# EAGLE board Anu-revC (EAGLE 5.09)
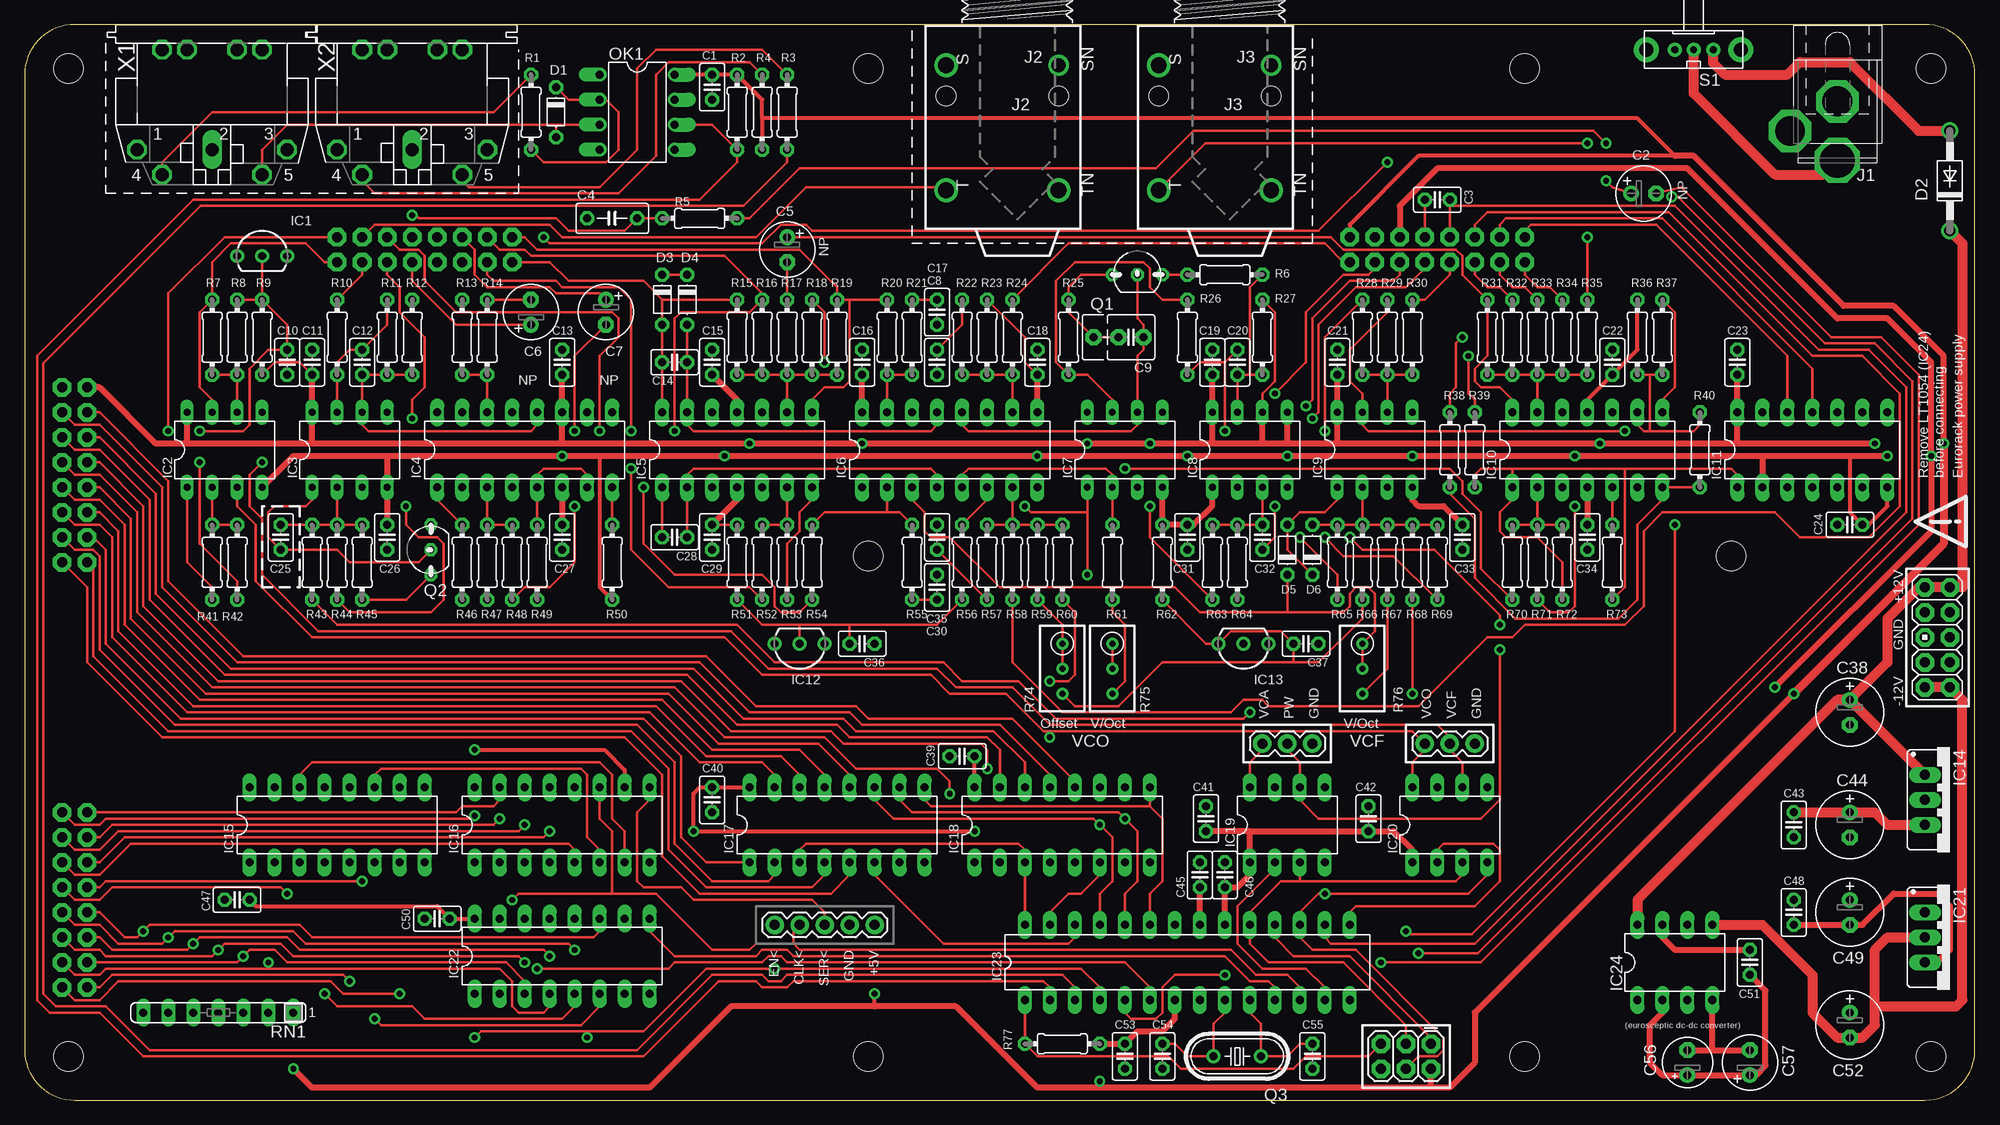
[diagram p5: board, top side]
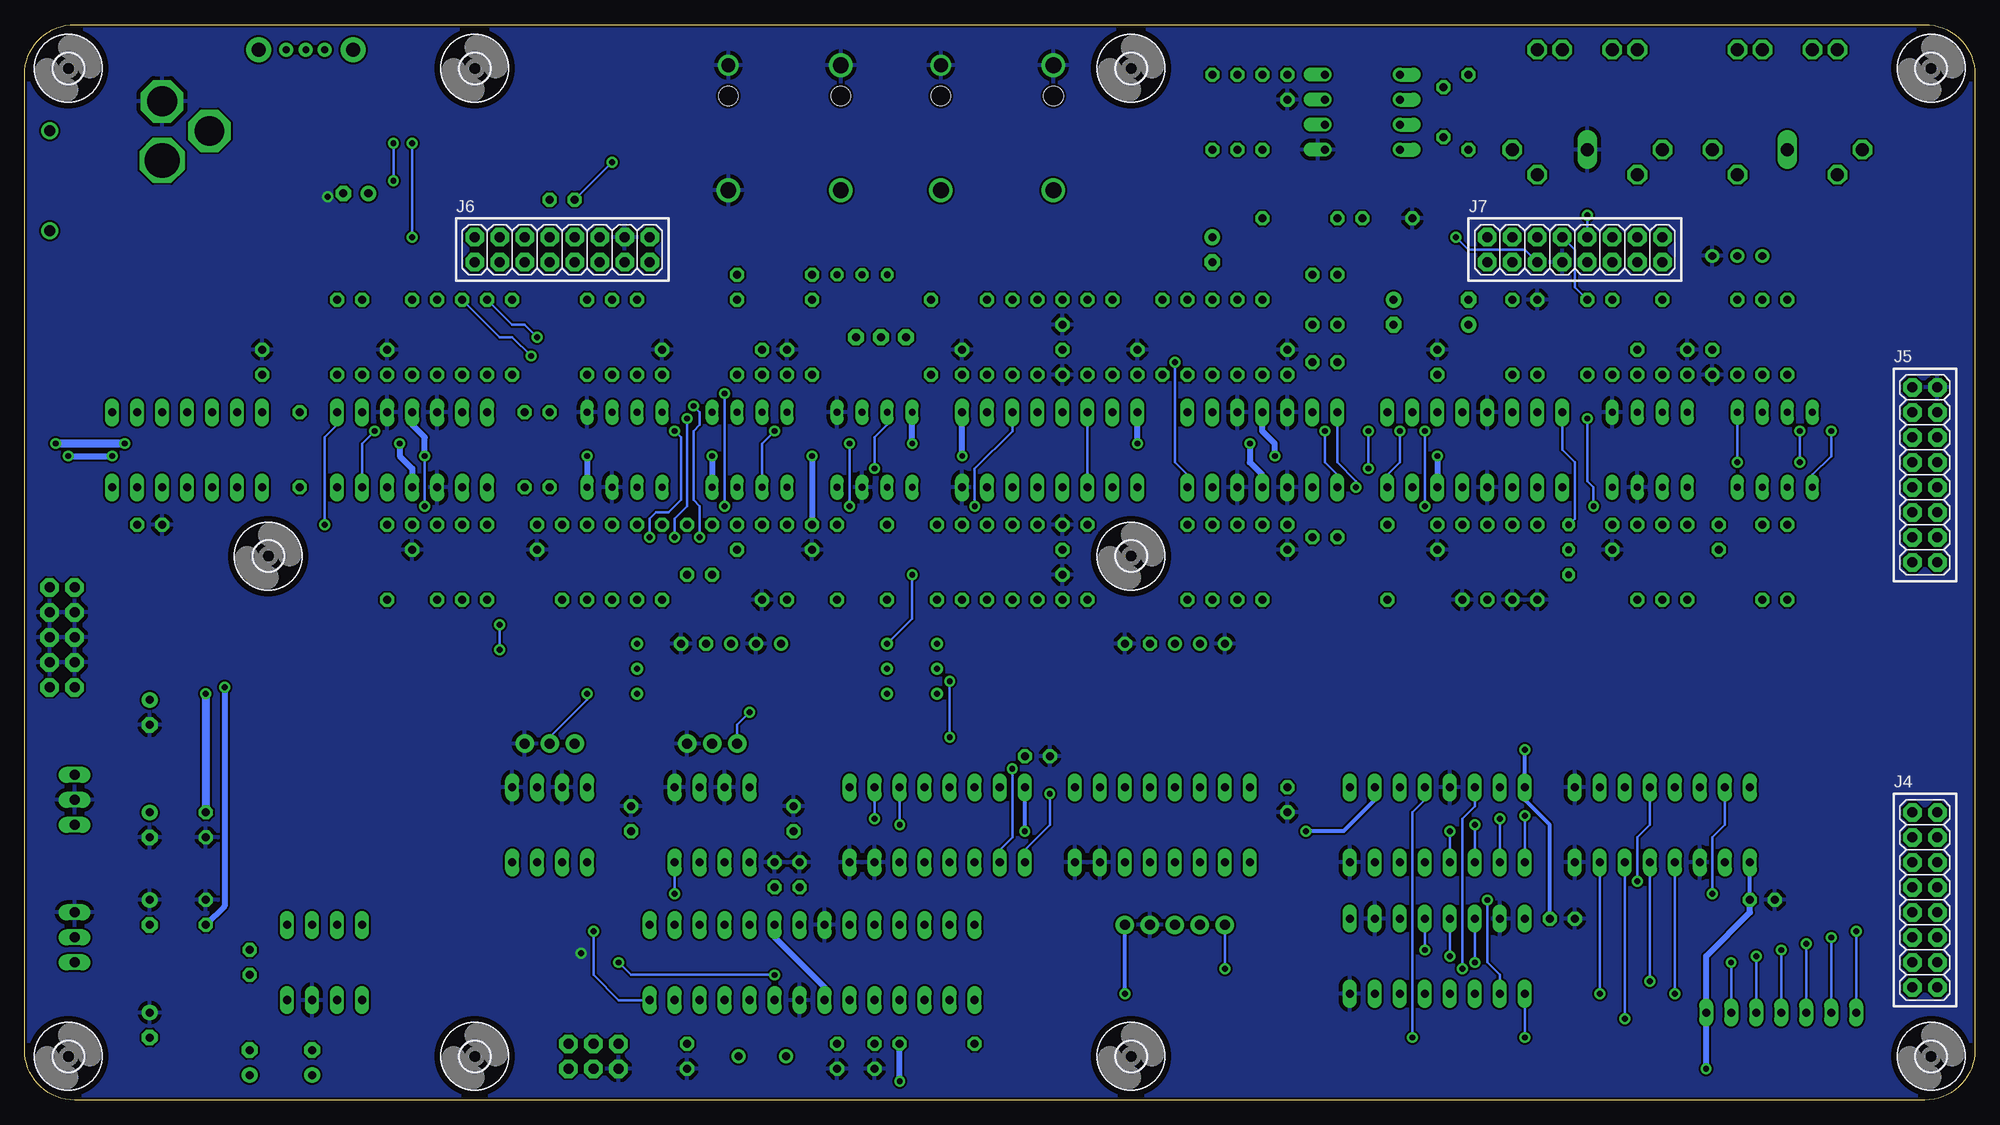
[diagram p6: board, bottom side, seen from below]

Size 198.12 x 109.22 mm. Coordinates in mm from the lower left corner, seen from the top.
Outline: 5.08,109.22 arc90 0,104.14 0,5.08 arc90 5.08,0 193.04,0 arc90 198.12,5.08 198.12,104.14 arc90 193.04,109.22 5.08,109.22
Copper layers (1*16): Top 0.035mm / dielectric 1.5mm / Bottom 0.035mm
Design rules "SparkFun *": minimum track width 8mil, minimum drill 20mil, track to track 8mil, track to pad 8mil, pad to pad 8mil, via to via 8mil, smd to smd 8mil, copper to edge 10mil, drill to drill 8mil, minimum pad ring 12mil, minimum via ring 10mil, stop-mask expansion 4mil, vias tented up to drill 25mil, thermal gap 16mil

## Footprints (pad centres in the part's own frame; a part is rotated, then mirrored left to right if it is on the bottom)
C025-025X050 = drill 0.813 octagon: 1 -1.27,0; 2 1.27,0
E2,5-6 = drill 0.813 pad 1.6 round: + -1.27,0 | drill 0.813 pad 1.6 octagon: - 1.27,0
C050-030X075 = drill 0.813 octagon: 1 -2.54,0; 2 2.54,0
C2.5/5-5 = drill 0.813 pad 1.6 octagon: 1 -1.27,0; 2 1.27,0; 3 3.81,0
E2,5-7 = drill 0.813 pad 1.6 round: + -1.27,0 | drill 0.813 pad 1.6 octagon: - 1.27,0
E2,5-5 = drill 0.813 pad 1.6 round: + -1.27,0 | drill 0.813 pad 1.6 octagon: - 1.27,0
D-5 = drill 0.813 octagon: A 2.54,0; C -2.54,0
DO41-10 = drill 1.118 round: A 5.08,0; C -5.08,0
LP_O-PBCY-W3 = drill 0.8 pad 1.4 round: 1 -2.54,0; 2 0,0; 3 2.54,0
DIL08 = drill 0.7 long: 1 -3.81,-3.81; 2 -1.27,-3.81; 3 1.27,-3.81; 4 3.81,-3.81; 5 3.81,3.81; 6 1.27,3.81; 7 -1.27,3.81; 8 -3.81,3.81
DIL16 = drill 0.813 long: 1 -8.89,-3.81; 2 -6.35,-3.81; 3 -3.81,-3.81; 4 -1.27,-3.81; 5 1.27,-3.81; 6 3.81,-3.81; 7 6.35,-3.81; 8 8.89,-3.81; 9 8.89,3.81; 10 6.35,3.81; 11 3.81,3.81; 12 1.27,3.81; 13 -1.27,3.81; 14 -3.81,3.81; 15 -6.35,3.81; 16 -8.89,3.81
DIL14 = drill 0.813 long: 1 -7.62,-3.81; 2 -5.08,-3.81; 3 -2.54,-3.81; 4 0,-3.81; 5 2.54,-3.81; 6 5.08,-3.81; 7 7.62,-3.81; 8 7.62,3.81; 9 5.08,3.81; 10 2.54,3.81; 11 0,3.81; 12 -2.54,3.81; 13 -5.08,3.81; 14 -7.62,3.81
78XXS = drill 1.016 long: GND 0,-2.54; IN -2.54,-2.54; OUT 2.54,-2.54
DIL08' = drill 0.813 long: 1 -3.81,-3.81; 2 -1.27,-3.81; 3 1.27,-3.81; 4 3.81,-3.81; 5 3.81,3.81; 6 1.27,3.81; 7 -1.27,3.81; 8 -3.81,3.81
79XXS = drill 1.016 long: GND -2.54,-2.54; IN 0,-2.54; OUT 2.54,-2.54
DIL28-3 = drill 0.813 long: 1 -16.51,-3.81; 2 -13.97,-3.81; 3 -11.43,-3.81; 4 -8.89,-3.81; 5 -6.35,-3.81; 6 -3.81,-3.81; 7 -1.27,-3.81; 8 1.27,-3.81; 9 3.81,-3.81; 10 6.35,-3.81; 11 8.89,-3.81; 12 11.43,-3.81; 13 13.97,-3.81; 14 16.51,-3.81; 15 16.51,3.81; 16 13.97,3.81; 17 11.43,3.81; 18 8.89,3.81; 19 6.35,3.81; 20 3.81,3.81; 21 1.27,3.81; 22 -1.27,3.81; 23 -3.81,3.81; 24 -6.35,3.81; 25 -8.89,3.81; 26 -11.43,3.81; 27 -13.97,3.81; 28 -16.51,3.81
2X3 = drill 1.016 pad 1.88 octagon: 1 0,0; 2 0,2.54; 3 2.54,0; 4 2.54,2.54; 5 5.08,0; 6 5.08,2.54
SPC4078_BIG_HOLES = drill 3.023 pad 4.318 octagon: 1 -0.46,0; 2 2.54,-4.8 | drill 3.531 pad 4.572 octagon: 3 5.54,0
NRJ4HF = drill 1.6 round: S 5.08,7.992; T -7.62,7.992; TN -7.62,-3.438 | drill 1.4 round: SN 5.08,-3.438 | hole 2: 1.948,7.992; 1.948,-3.438
2X8 = drill 1.016 pad 1.88 octagon: 1 0,0; 2 0,2.54; 3 2.54,0; 4 2.54,2.54; 5 5.08,0; 6 5.08,2.54; 7 7.62,0; 8 7.62,2.54; 9 10.16,0; 10 10.16,2.54; 11 12.7,0; 12 12.7,2.54; 13 15.24,0; 14 15.24,2.54; 15 17.78,0; 16 17.78,2.54
AVR_ICSP = drill 1.016 pad 1.88 octagon: 1 -1.27,5.08; 2 1.27,5.08; 3 -1.27,2.54; 4 1.27,2.54; 5 -1.27,0; 6 1.27,0; 7 -1.27,-2.54; 8 1.27,-2.54; 9 -1.27,-5.08; 10 1.27,-5.08
1X03 = drill 1.016 pad 1.88 round: 1 0,0; 2 2.54,0; 3 5.08,0
1X05 = drill 1.016 pad 1.88 round: 1 0,0; 2 2.54,0; 3 5.08,0; 4 7.62,0; 5 10.16,0
DIL08'' = drill 0.813 offset: 1 -3.81,-3.81; 2 -1.27,-3.81; 3 1.27,-3.81; 4 3.81,-3.81; 5 3.81,3.81; 6 1.27,3.81; 7 -1.27,3.81; 8 -3.81,3.81
TO92- = drill 0.7 octagon: 1 2.54,0; 2 0,0; 3 -2.54,0
HC49U-V = drill 0.813 round: 1 -2.413,0; 2 2.413,0
0204/7 = drill 0.813 octagon: 1 -3.81,0; 2 3.81,0
RTRIM3296W = drill 0.61 round: 1 0,-2.54; 2 0,0; 3 0,2.54
SIL7 = drill 0.813 long: 1 -7.62,0; 2 -5.08,0; 3 -2.54,0; 4 0,0; 5 2.54,0; 6 5.08,0; 7 7.62,0
EG1213 = drill 0.7 pad 1.422 round: 1 -2,0; 2 0,0; 3 1.9,0 | drill 1.4 pad 2.54 round: MT1 -4.8,0; MT2 4.8,0
3,0 = hole 3: 0,0
MAB5SH = drill 1.321 octagon: 1 7.62,7.62; 3 -7.62,7.62; 4 5.08,10.16; 5 -5.08,10.16; P$1 -5.08,-2.54; P$2 -2.54,-2.54; P$3 2.54,-2.54; P$4 5.08,-2.54 | drill 1.321 long: 2 0,7.62

## Placement (x,y rotation side)
C1  100n  [C025-025X050]  69.85,102.87 270 top
C2  4.7u  [E2,5-6]  164.47,92.08 0 top
C3  100n  [C025-025X050]  143.51,91.44 0 top
C4  22n  [C050-030X075]  59.69,89.53 180 top
C5  4.7u  [E2,5-6]  77.47,86.36 270 top
C6  4.7u  [E2,5-6]  51.44,80.01 90 top
C7  4.7u  [E2,5-6]  59.05,80.01 270 top
C8  560p  [C025-025X050]  92.71,80.01 270 top
C9  2.2n  [C2.5/5-5]  112.39,77.47 180 top
C10  100n  [C025-025X050]  26.67,74.93 270 top
C11  100n  [C025-025X050]  29.21,74.93 90 top
C12  100p  [C025-025X050]  34.29,74.93 90 top
C13  100n  [C025-025X050]  54.61,74.93 90 top
C14  220p  [C025-025X050]  66.04,74.93 180 top
C15  100n  [C025-025X050]  69.85,74.93 270 top
C16  100n  [C025-025X050]  85.09,74.93 90 top
C17  560p  [C025-025X050]  92.71,74.93 270 top
C18  100n  [C025-025X050]  102.87,74.93 270 top
C19  100n  [C025-025X050]  120.65,74.93 90 top
C20  10p  [C025-025X050]  123.19,74.93 270 top
C21  100n  [C025-025X050]  133.35,74.93 90 top
C22  100n  [C025-025X050]  161.29,74.93 270 top
C23  100n  [C025-025X050]  173.99,74.93 90 top
C24  100n  [C025-025X050]  185.42,58.42 0 top
C25  100n  [C025-025X050]  26.04,57.15 270 top
C26  100n  [C025-025X050]  36.83,57.15 90 top
C27  100n  [C025-025X050]  54.61,57.15 90 top
C28  220p  [C025-025X050]  66.04,57.15 180 top
C29  100n  [C025-025X050]  69.85,57.15 270 top
C30  560p  [C025-025X050]  92.71,57.15 90 top
C31  100n  [C025-025X050]  118.11,57.15 90 top
C32  560p  [C025-025X050]  125.73,57.15 270 top
C33  100n  [C025-025X050]  146.05,57.15 90 top
C34  100n  [C025-025X050]  158.75,57.15 270 top
C35  560p  [C025-025X050]  92.71,52.07 90 top
C36  100n  [C025-025X050]  85.09,46.35 0 top
C37  100n  [C025-025X050]  130.18,46.35 0 top
C38  100u  [E2,5-7]  185.42,39.37 270 top
C39  100n  [C025-025X050]  95.25,34.92 180 top
C40  100n  [C025-025X050]  69.85,30.48 270 top
C41  100n  [C025-025X050]  120.02,28.57 90 top
C42  100n  [C025-025X050]  136.53,28.57 90 top
C43  100n  [C025-025X050]  179.71,27.94 270 top
C44  100u  [E2,5-7]  185.42,27.94 270 top
C45  100n  [C025-025X050]  119.38,22.86 90 top
C46  100n  [C025-025X050]  121.92,22.86 90 top
C47  100n  [C025-025X050]  21.59,20.32 180 top
C48  100n  [C025-025X050]  179.71,19.05 270 top
C49  100u  [E2,5-7]  185.42,19.05 270 top
C50  100n  [C025-025X050]  41.91,18.41 180 top
C51  10p  [C025-025X050]  175.26,13.97 90 top
C52  100u  [E2,5-7]  185.42,7.62 270 top
C53  100n  [C025-025X050]  111.76,4.45 270 top
C54  18p  [C025-025X050]  115.57,4.45 90 top
C55  18p  [C025-025X050]  130.81,4.45 90 top
C56  10u  [E2,5-5]  168.91,3.81 90 top
C57  100u  [E2,5-6]  175.26,3.81 90 top
D1  1N4148  [D-5]  53.98,100.33 270 top
D2  1N4001  [DO41-10]  195.58,93.34 90 top
D3  3.6V  [D-5]  64.77,81.28 270 top
D4  3.6V  [D-5]  67.31,81.28 270 top
D5  1N4148  [D-5]  128.27,55.88 90 top
D6  1N4148  [D-5]  130.81,55.88 90 top
IC1  LM4040 4.1V  [LP_O-PBCY-W3]  24.13,85.72 0 top
IC2  TS912  [DIL08]  20.32,66.04 0 top
IC3  TL072P  [DIL08]  33.02,66.04 0 top
IC4  LM13700N  [DIL16]  50.8,66.04 0 top
IC5  TL074  [DIL14]  72.39,66.04 0 top
IC6  V2164D  [DIL16]  93.98,66.04 0 top
IC7  TL072P  [DIL08]  111.76,66.04 0 top
IC8  LM311N  [DIL08]  124.46,66.04 0 top
IC9  TL072P  [DIL08]  137.16,66.04 0 top
IC10  TL074  [DIL14]  158.75,66.04 0 top
IC11  4024N  [DIL14]  181.61,66.04 0 top
IC12  LM4040 4.1V  [LP_O-PBCY-W3]  78.74,46.35 180 top
IC13  LM4040 4.1V  [LP_O-PBCY-W3]  123.83,46.35 180 top
IC14  7805  [78XXS]  195.58,30.48 270 top
IC15  4050N  [DIL16]  31.75,27.94 0 top
IC16  74HC595N  [DIL16]  54.61,27.94 0 top
IC17  4051N  [DIL16]  82.55,27.94 0 top
IC18  4051N  [DIL16]  105.41,27.94 0 top
IC19  MCP4822  [DIL08']  128.27,27.94 0 top
IC20  MCP4822  [DIL08']  144.78,27.94 0 top
IC21  7905  [79XXS]  195.58,16.51 270 top
IC22  74HC165N  [DIL16]  54.61,14.61 0 top
IC23  ATMega328p  [DIL28-3]  118.11,13.97 0 top
IC24  LT1054  [DIL08']  167.64,13.97 0 top
ISP  AVR_ISP  [2X3]  142.88,5.71 180 top
J1  [SPC4078_BIG_HOLES]  184.15,100.97 270 top
J2  MONOSWSLIM  [NRJ4HF]  101.6,100.01 90 top
J3  MONOSWSLIM  [NRJ4HF]  123.19,100.01 90 top
J4  [2X8]  6.35,29.21 270 bottom
J5  [2X8]  6.35,72.39 270 bottom
J6  [2X8]  152.4,85.09 0 bottom
J7  [2X8]  49.53,85.09 0 bottom
JP1  M05X2PTH  [AVR_ICSP]  194.31,46.99 0 top
JP2  [1X03]  125.73,36.2 0 top
JP3  [1X03]  142.24,36.2 0 top
JP4  [1X05]  76.2,17.78 0 top
OK1  6N137  [DIL08'']  62.23,100.33 270 top
Q1  2N5485  [TO92-]  113.03,83.82 0 top
Q2  2N3906  [TO92-]  41.27,55.88 90 top
Q3  20MHz  [HC49U-V]  123.19,4.45 180 top
R1  220  [0204/7]  51.44,100.33 270 top
R2  10k  [0204/7]  72.39,100.33 90 top
R3  220  [0204/7]  74.93,100.33 270 top
R4  220  [0204/7]  77.47,100.33 90 top
R5  470  [0204/7]  68.58,89.53 0 top
R6  470  [0204/7]  121.92,83.82 180 top
R7  100k  [0204/7]  19.05,77.47 270 top
R8  100k  [0204/7]  21.59,77.47 270 top
R9  470  [0204/7]  24.13,77.47 270 top
R10  470  [0204/7]  31.75,77.47 270 top
R11  22k  [0204/7]  36.83,77.47 270 top
R12  33k  [0204/7]  39.37,77.47 90 top
R13  220  [0204/7]  44.45,77.47 270 top
R14  22k  [0204/7]  46.99,77.47 90 top
R15  200k  [0204/7]  72.39,77.47 270 top
R16  33k  [0204/7]  74.93,77.47 90 top
R17  33k  [0204/7]  77.47,77.47 270 top
R18  15k  [0204/7]  80.01,77.47 90 top
R19  33k  [0204/7]  82.55,77.47 90 top
R20  33k  [0204/7]  87.63,77.47 270 top
R21  470  [0204/7]  90.17,77.47 270 top
R22  470  [0204/7]  95.25,77.47 270 top
R23  22k  [0204/7]  97.79,77.47 270 top
R24  33k  [0204/7]  100.33,77.47 270 top
R25  4.7k  [0204/7]  106.05,77.47 90 top
R26  22k  [0204/7]  118.11,77.47 270 top
R27  470  [0204/7]  125.73,77.47 90 top
R28  12k  [0204/7]  135.89,77.47 270 top
R29  10k  [0204/7]  138.43,77.47 90 top
R30  15k  [0204/7]  140.97,77.47 270 top
R31  33k  [0204/7]  148.59,77.47 90 top
R32  150k  [0204/7]  151.13,77.47 270 top
R33  100k  [0204/7]  153.67,77.47 270 top
R34  100k  [0204/7]  156.21,77.47 270 top
R35  15k  [0204/7]  158.75,77.47 270 top
R36  22k  [0204/7]  163.83,77.47 270 top
R37  10k  [0204/7]  166.37,77.47 90 top
R38  4.7k  [0204/7]  144.78,66.04 90 top
R39  4.7k  [0204/7]  147.32,66.04 90 top
R40  22k  [0204/7]  170.18,66.04 90 top
R41  100k  [0204/7]  19.05,54.61 270 top
R42  100k  [0204/7]  21.59,54.61 90 top
R43  22k  [0204/7]  29.21,54.61 90 top
R44  22k  [0204/7]  31.75,54.61 90 top
R45  4.7k  [0204/7]  34.29,54.61 270 top
R46  22k  [0204/7]  44.45,54.61 270 top
R47  22k  [0204/7]  46.99,54.61 270 top
R48  100k  [0204/7]  49.53,54.61 90 top
R49  10k  [0204/7]  52.07,54.61 90 top
R50  4.7k  [0204/7]  59.69,54.61 90 top
R51  470  [0204/7]  72.39,54.61 90 top
R52  4.7k  [0204/7]  74.93,54.61 90 top
R53  4.7k  [0204/7]  77.47,54.61 270 top
R54  33k  [0204/7]  80.01,54.61 90 top
R55  470  [0204/7]  90.17,54.61 90 top
R56  68k  [0204/7]  95.25,54.61 90 top
R57  470  [0204/7]  97.79,54.61 90 top
R58  200k  [0204/7]  100.33,54.61 90 top
R59  68k  [0204/7]  102.87,54.61 90 top
R60  100k  [0204/7]  105.41,54.61 90 top
R61  100k  [0204/7]  110.49,54.61 270 top
R62  470  [0204/7]  115.57,54.61 270 top
R63  10k  [0204/7]  120.65,54.61 270 top
R64  10k  [0204/7]  123.19,54.61 90 top
R65  200k  [0204/7]  133.35,54.61 90 top
R66  62k  [0204/7]  135.89,54.61 90 top
R67  33k  [0204/7]  138.43,54.61 270 top
R68  49.9k  [0204/7]  140.97,54.61 90 top
R69  200k  [0204/7]  143.51,54.61 90 top
R70  10k  [0204/7]  151.13,54.61 90 top
R71  39k  [0204/7]  153.67,54.61 90 top
R72  27k  [0204/7]  156.21,54.61 270 top
R73  10k  [0204/7]  161.29,54.61 90 top
R74  10k  [RTRIM3296W]  105.41,43.81 180 top
R75  10k  [RTRIM3296W]  110.49,43.81 180 top
R76  10k  [RTRIM3296W]  135.89,43.81 180 top
R77  10k  [0204/7]  105.41,5.71 0 top
RN1  10k  [SIL7]  19.68,8.89 180 top
S1  EG1213  [EG1213]  169.54,106.68 180 top
U$2  [BOX]  152.4,22.23 0 top
U$3  [3,0]  193.68,4.45 0 bottom
U$4  [3,0]  152.4,4.45 0 bottom
U$5  [3,0]  85.72,4.45 0 bottom
U$6  [3,0]  4.45,4.45 0 bottom
U$7  [3,0]  173.35,55.24 0 bottom
U$8  [3,0]  85.72,55.24 0 bottom
U$9  [3,0]  193.68,104.78 0 bottom
U$10  [3,0]  152.4,104.78 0 bottom
U$11  [3,0]  85.72,104.78 0 bottom
U$12  [3,0]  4.45,104.78 0 bottom
U$13  [V2_LOGO_ANUSHRI_MAIN_BOARD]  4.76,37.47 0 top
X1  MIDI_IN  [MAB5SH]  19.05,104.14 180 top
X2  MIDI_OUT  [MAB5SH]  39.37,104.14 180 top

## Tracks (layer width: path | path; a pad name or v marks a point on that pad's centre or on a via)
-1_OCT
  Top 0.254: IC11.12 179.07,75.56 165.74,88.9 153.03,88.9 152.4,88.27 J6.2
-2_OCT
  Top 0.254: IC11.11 181.61,74.3 166.37,89.53 150.5,89.53 149.86,88.9 J6.4
ADC
  Top 0.254: IC23.28 IC18.3 101.6,25.4 100.97,26.04 79.38,26.04 78.74,25.4 IC17.3
ADC_ADDR0  (via drill 0.6)
  Top 0.254: IC23.25 109.22,20.95 110.49,22.23 110.49,26.67 v109.22,27.94 108.58,28.57 88.27,28.57 86.36,30.48 IC17.11
  Bottom 0.254: v109.22,27.94 IC18.11
ADC_ADDR1  (via drill 0.6)
  Top 0.254: IC23.24 111.76,20.95 113.03,22.23 113.03,27.3 v111.76,28.57 111.12,29.21 90.17,29.21 88.9,30.48 IC17.10
  Bottom 0.254: v111.76,28.57 IC18.10
ADC_ADDR2
  Top 0.254: 114.3,29.84 92.08,29.84 91.44,30.48 IC17.9 | IC23.23 114.3,20.95 115.57,22.23 115.57,28.57 114.3,29.84 | 114.3,29.84 IC18.9
ADC_ADDR3
  Top 0.254: IC23.26 106.68,16.51 106.05,15.88 93.34,15.88 86.36,22.86 IC17.6
ADC_ADDR4
  Top 0.254: IC18.6 109.22,22.86 107.31,20.95 106.05,20.95 104.14,19.05 IC23.27
AREF
  Top 0.61: IC23.21 C45.1
BP  (via drill 0.6)
  Top 0.254: IC5.14 C14.2 D3.A 64.77,81.28 | v62.87,62.23 62.87,56.52 66.04,53.34 74.93,53.34 76.2,52.07 76.2,50.16 76.83,49.53 78.74,49.53 R54.1 | 64.77,81.28 62.87,83.19 55.24,83.19 53.34,85.09 J7.1 | 64.77,81.28 R15.1
  Bottom 0.254: v62.87,62.23 62.87,62.87 64.77,64.77 IC5.14
CLK_OUT  (via drill 0.6)
  Top 0.254: v26.67,20.95 26.04,21.59 8.89,21.59 7.62,20.32 5.08,20.32 J4.8
  Bottom 0.254: v26.67,20.95 26.67,26.67 25.4,27.94 IC15.15
CUTOFF_POT  (via drill 0.6)
  Top 0.254: v130.18,70.48 130.81,71.12 130.81,79.38 134.62,83.19 139.06,83.19 139.7,83.82 J6.11 | R65.1 133.35,53.34 v129.54,57.15
  Bottom 0.254: v130.18,70.48 129.54,69.85 129.54,68.58 130.18,67.94 130.18,60.96 129.54,60.33 v129.54,57.15
DAC_CUTOFF  (via drill 0.6)
  Top 0.254: v24.13,64.77 22.86,63.5 22.86,60.33 24.13,59.05 24.13,53.34 29.84,47.62 71.75,47.62 75.56,43.81 92.71,43.81 94.61,41.91 100.33,41.91 104.14,38.1 143.51,38.1 144.78,36.83 JP3.2 144.78,35.56 146.05,34.29 IC20.6 | v140.97,41.27 R68.1
  Bottom 0.254: v24.13,64.77 IC2.5 | v140.97,41.27 140.97,40.64 144.78,36.83 JP3.2
DAC_GAIN  (via drill 0.6)
  Top 0.254: v124.46,39.37 123.83,38.73 104.78,38.73 100.97,42.55 95.25,42.55 93.34,44.45 76.2,44.45 72.39,48.26 36.2,48.26 34.92,48.26 31.75,48.26 R43.1 | JP2.1 125.73,35.56 124.46,34.29 IC19.8
  Bottom 0.254: v124.46,39.37 125.73,38.1 JP2.1
DAC_PITCH  (via drill 0.6)
  Top 0.254: 104.14,37.47 103.5,37.47 99.69,41.27 93.98,41.27 92.08,43.18 74.93,43.18 71.12,46.99 29.21,46.99 23.5,52.7 23.5,58.42 21.59,60.33 IC2.3 | 104.14,37.47 v104.14,36.83 | IC20.8 140.97,34.29 142.24,35.56 JP3.1 140.97,37.47 104.14,37.47 | v104.14,42.55 106.05,42.55 106.68,43.18 106.68,49.53 R60.1
  Bottom 0.254: v104.14,36.83 v104.14,42.55
DAC_PW  (via drill 0.6)
  Top 0.254: R28.1 132.08,77.47 v132.08,67.94 | v134.62,57.15 135.89,55.88 143.19,55.88 149.86,49.21 v149.86,48.26 | JP2.2 128.27,35.56 129.54,34.29 IC19.6 129.54,30.48 131.44,28.57 147.96,28.57 149.86,30.48 v149.86,45.72
  Bottom 0.254: v134.62,57.15 134.62,59.05 133.99,59.69 132.72,59.69 131.44,60.96 131.44,67.31 v132.08,67.94 | v149.86,45.72 v149.86,48.26
DRUMS_OUT  (via drill 0.6)
  Top 0.254: R5.1 C4.1 60.96,88.27 55.24,88.27 53.98,89.53 40.01,89.53 39.69,89.85 v39.37,89.85
  Bottom 0.254: J7.10 v39.37,89.85
DRUMS_RETURN
  Bottom 0.254: R12.2 40.64,82.55 40.64,86.36 J7.8
DSQUARE
  Top 0.254: IC23.16 132.08,16.51 132.72,15.88 147.32,15.88 191.13,59.69 191.13,72.39 187.32,76.2 182.25,76.2 167.64,90.81 144.78,90.81 | 144.78,90.81 C3.2 | 144.78,90.81 J6.8
ENV_VCF
  Top 0.254: IC18.14 101.6,34.29 98.42,37.47 84.45,37.47 83.19,38.73 73.03,38.73 67.94,43.81 20.95,43.81 13.34,51.44 13.34,61.59 7.62,67.31 J5.5
F_CV
  Top 0.254: IC6.3 90.17,60.96 91.44,59.69 91.44,57.78 92.08,57.15 93.98,57.15 99.06,52.07 116.84,52.07 119.38,49.53 128.27,49.53 | 128.27,49.53 D5.C | 128.27,49.53 133.99,49.53 134.62,50.16 134.62,51.44 135.25,52.07 136.53,52.07 137.16,51.44 137.16,47.62 R76.1 R76.2
  Bottom 0.254: IC6.3 IC6.14
FM_IN  (via drill 0.6)
  Top 0.254: v138.43,95.25 131.44,88.27 80.01,88.27 79.38,88.9 76.83,88.9 74.93,87 53.34,87 v52.7,87.63 | C3.1 J6.10
  Bottom 0.254: v138.43,95.25 C3.1 | v52.7,87.63 51.44,86.36 45.72,86.36 J7.5
FM_OUT
  Top 0.254: R24.1 106.05,87 132.08,87 133.99,85.09 J6.15
GATE_OUT  (via drill 0.6)
  Top 0.254: v34.29,22.23 8.26,22.23 7.62,21.59 J4.7
  Bottom 0.254: v34.29,22.23 34.29,26.67 33.02,27.94 IC15.12
GND  (via drill 0.6)
  Top 0.254: v167.32,91.76 167.96,91.76 182.88,76.83 187.96,76.83 191.77,73.03 191.77,59.05 147.64,14.92 v141.6,14.92
  pour Bottom: 0,5.08 arc90 5.08,0 193.04,0 arc90 198.12,5.08 198.12,104.14 arc90 193.04,109.22 5.08,109.22 arc90 0,104.14
HP
  Top 0.254: 83.82,81.28 R19.2 82.55,82.55 78.74,86.36 52.07,86.36 50.8,87.63 J7.2 | 83.82,81.28 R20.1 | IC5.8 80.01,71.12 81.28,72.39 83.19,72.39 83.82,73.03 83.82,81.28
IN1  (via drill 0.6)
  Top 0.254: IC22.11 58.42,17.14 57.78,16.51 29.21,16.51 27.94,17.78 12.7,17.78 v12.06,17.14 11.43,16.51 10.16,16.51 7.62,19.05 J4.9
  Bottom 0.254: RN1.7 v12.06,17.14
IN2  (via drill 0.6)
  Top 0.254: v55.88,15.24 55.24,15.88 28.57,15.88 27.3,17.14 15.24,17.14 v14.61,16.51 13.97,15.88 9.53,15.88 7.62,17.78 5.08,17.78 J4.10
  Bottom 0.254: v55.88,15.24 IC22.12 | RN1.6 v14.61,16.51
IN3  (via drill 0.6)
  Top 0.254: v53.34,14.61 52.7,15.24 27.94,15.24 26.67,16.51 17.78,16.51 v17.14,15.88 16.51,15.24 8.89,15.24 7.62,16.51 J4.11
  Bottom 0.254: v53.34,14.61 IC22.13 | v17.14,15.88 RN1.5
IN4  (via drill 0.6)
  Top 0.254: v50.8,13.97 50.16,14.61 27.3,14.61 26.04,15.88 20.32,15.88 v19.68,15.24 19.05,14.61 8.26,14.61 7.62,15.24 5.08,15.24 J4.12
  Bottom 0.254: v50.8,13.97 IC22.14 | v19.68,15.24 RN1.4
IN5  (via drill 0.6)
  Top 0.254: IC22.3 50.8,12.06 48.9,13.97 26.67,13.97 25.4,15.24 22.86,15.24 v22.23,14.61 21.59,13.97 J4.13
  Bottom 0.254: v22.23,14.61 RN1.3
IN6  (via drill 0.6)
  Top 0.254: IC22.4 53.34,9.53 52.7,8.89 50.16,8.89 49.53,9.53 49.53,12.06 48.26,13.34 24.77,13.34 | J4.14 5.08,12.7 7.62,12.7 8.26,13.34 24.77,13.34 | 24.77,13.34 v24.77,13.97
  Bottom 0.254: v24.77,13.97 RN1.2
IN7  (via drill 0.6)
  Top 0.254: v33.02,12.06 32.38,12.7 8.89,12.7 7.62,11.43 J4.15
  Bottom 0.254: v33.02,12.06 IC15.5
IN8  (via drill 0.6)
  Top 0.254: v38.1,10.79 32.38,10.79 31.11,12.06 9.53,12.06 7.62,10.16 5.08,10.16 J4.16
  Bottom 0.254: v38.1,10.79 IC15.7
IO_ENABLE  (via drill 0.6)
  Top 0.254: 57.15,6.99 46.35,6.99 v45.72,6.35 | 57.15,6.99 62.87,6.99 69.22,13.34 v76.2,13.34 107.31,13.34 109.22,11.43 IC23.4 | 57.15,6.99 v57.15,6.35
  Bottom 0.254: v45.72,6.35 IC22.1 | IC16.12 55.88,30.48 57.15,29.21 v57.15,6.35 | v76.2,13.34 JP4.1
IO_INPUT
  Top 0.254: IC23.11 127,11.43 126.36,12.06 124.46,12.06 121.92,14.61 78.11,14.61 77.47,15.24 74.93,15.24 74.3,14.61 66.04,14.61 63.5,17.14 IC22.9
IO_OUTPUT  (via drill 0.6)
  Top 0.254: IC23.6 114.3,11.43 111.76,13.97 77.47,13.97 76.83,14.61 75.56,14.61 74.93,13.97 66.04,13.97 65.41,13.34 v52.07,13.34
  Bottom 0.254: v52.07,13.34 52.07,28.57 50.8,29.84 IC16.14
IO_SCK  (via drill 0.6)
  Top 0.254: IC23.12 129.54,11.43 128.27,12.7 125.09,12.7 122.56,15.24 78.74,15.24 78.11,15.88 | 78.11,15.88 74.3,15.88 73.66,15.24 69.85,15.24 64.14,20.95 59.69,20.95 | IC16.11 58.42,28.57 59.69,27.3 59.69,20.95 | 59.69,20.95 50.16,20.95 v49.53,20.32 | JP4.2 78.11,17.14 78.11,15.88
  Bottom 0.254: v49.53,20.32 49.53,13.97 48.26,12.7 IC22.2
IO_XT
  Top 0.254: IC16.9 63.5,30.48 62.23,29.21 62.23,22.23 62.87,21.59 66.67,21.59 67.94,20.32 80.01,20.32 81.28,19.05 JP4.3
LED1
  Top 0.254: IC16.15 48.26,30.48 47.62,29.84 44.45,29.84 43.81,29.21 J4.1
LED2  (via drill 0.6)
  Top 0.254: v45.72,28.89 45.4,28.57 8.26,28.57 7.62,27.94 5.08,27.94 J4.2
  Bottom 0.254: v45.72,28.89 IC16.1
LED3  (via drill 0.6)
  Top 0.254: v48.26,28.57 47.62,27.94 8.89,27.94 7.62,26.67 J4.3
  Bottom 0.254: v48.26,28.57 IC16.2
LED4  (via drill 0.6)
  Top 0.254: v50.8,27.94 50.16,27.3 9.53,27.3 7.62,25.4 5.08,25.4 J4.4
  Bottom 0.254: IC16.3 v50.8,27.94 50.48,27.62
LED5  (via drill 0.6)
  Top 0.254: v53.34,27.3 52.7,26.67 10.16,26.67 7.62,24.13 J4.5
  Bottom 0.254: v53.34,27.3 IC16.4
LED6
  Top 0.254: IC16.5 55.88,25.4 55.24,26.04 10.79,26.04 7.62,22.86 5.08,22.86 J4.6
LFO_VCF
  Top 0.254: IC18.13 104.14,33.02 99.06,38.1 85.09,38.1 83.82,39.37 73.66,39.37 68.58,44.45 21.59,44.45 13.97,52.07 13.97,62.23 7.62,68.58 5.08,68.58 J5.4
LP  (via drill 0.6)
  Top 0.254: C28.2 IC5.1 | v66.04,67.94 66.04,79.38 66.67,80.01 73.66,80.01 R16.2 74.93,81.92 71.12,85.72 51.44,85.72 50.8,86.36 48.26,86.36 J7.4
  Bottom 0.254: IC5.1 64.77,63.5 66.04,64.77 v66.04,67.94
MIDI_IN
  Top 0.254: OK1.6 69.85,99.06 R2.1 72.39,95.25 68.58,91.44 17.14,91.44 1.27,75.56 1.27,10.16 2.54,8.89 7.62,8.89 12.06,4.45 62.87,4.45 70.48,12.06 74.3,12.06 74.93,11.43 77.47,11.43 78.11,12.06 103.5,12.06 104.14,11.43 IC23.2
MIDI_IN4
  Top 0.254: R1.1 47.62,100.33 19.05,100.33 13.97,95.25 X1.4
MIDI_IN5
  Top 0.254: 53.98,99.06 OK1.3 | X1.5 24.13,96.52 26.67,99.06 53.98,99.06 | 53.98,99.06 D1.A
MIDI_OUT
  Top 0.254: IC23.3 106.68,11.43 105.41,12.7 77.47,12.7 76.83,12.06 75.56,12.06 74.93,12.7 69.85,12.7 62.23,5.08 12.7,5.08 8.26,9.53 3.17,9.53 1.91,10.79 1.91,74.82 17.89,90.81 73.03,90.81 77.47,95.25 R4.1
MIDI_OUT3
  Top 0.254: R3.1 73.66,105.41 65.41,105.41 64.14,104.14 64.14,95.89 60.33,92.08 35.56,92.08 34.29,93.34 X2.4
MIDI_OUT5
  Top 0.254: R4.2 74.93,106.68 64.14,106.68 62.23,104.78 62.23,96.52 58.42,92.71 45.09,92.71 44.45,93.34 X2.5
MISO
  Top 0.254: IC23.18 127,16.51 128.91,14.61 134.62,14.61 142.88,6.35 ISP.1
MIX
  Top 0.254: C5.+ 132.72,87.63 133.99,86.36 145.41,86.36 146.05,85.72 146.05,83.82 R31.2 148.59,75.56 147.32,74.3 147.32,73.03 147.96,72.39 149.86,72.39 151.13,71.12 IC10.14
MIX_SAW  (via drill 0.6)
  Top 0.254: v146.69,75.56 146.69,71.75 147.32,71.12 R39.2 | J6.3 149.86,83.82 151.13,82.55 152.4,82.55 R33.1
  Bottom 0.254: R33.1 149.86,77.47 148.59,77.47 v146.69,75.56
MIX_SQUARE  (via drill 0.6)
  Top 0.254: R38.2 144.78,71.75 145.41,72.39 145.41,76.83 v146.05,77.47 | J6.5 147.32,83.82 148.59,82.55 149.86,82.55 R32.1
  Bottom 0.254: v146.05,77.47 147.32,78.74 148.59,78.74 R32.1
MOSI  (via drill 0.6)
  Top 0.254: IC20.4 148.59,22.86 146.69,20.95 v132.08,20.95 131.44,20.95 129.54,19.05 IC23.17 129.54,16.51 130.81,15.24 135.25,15.24 144.15,6.35 144.15,5.08 143.51,4.45 141.6,4.45 ISP.4
  Bottom 0.254: v132.08,20.95 IC19.4
N$1  (via drill 0.6)
  Top 0.254: v101.6,60.33 102.23,59.69 107.95,59.69 | R75.2 R75.1 | v107.95,53.34 107.95,59.69 | 107.95,59.69 IC7.1
  Bottom 0.254: v101.6,60.33 101.6,64.14 97.79,67.94 IC6.11 | R75.1 107.95,48.9 v107.95,53.34
N$2
  Top 0.254: 124.46,73.66 C20.2 IC8.7 | 124.46,73.66 R27.1 | 124.46,73.66 124.46,82.55 R6.1
N$3
  Top 0.254: IC16.6 58.42,25.4 57.15,26.67 57.15,33.02 56.52,33.66 36.2,33.66 35.56,33.02 IC15.11
N$4
  Top 0.254: IC16.7 60.96,27.3 59.69,28.57 59.69,33.02 58.42,34.29 29.21,34.29 27.94,33.02 IC15.14
N$5  (via drill 0.6)
  Top 0.254: R5.2 73.66,89.53 78.74,94.61 114.94,94.61 118.75,98.42 159.38,98.42 v160.66,97.16 | v160.66,93.34 161.29,92.71 C2.+
  Bottom 0.254: v160.66,93.34 v160.66,97.16
N$6
  Top 1.016: J1.3 182.71,93.98 177.8,93.98 169.54,102.23 S1.2
N$7
  Top 1.016: D2.A 192.41,98.42 185.42,105.41 180.34,105.41 179.07,104.14 172.72,104.14 171.54,105.31 S1.1
N$8
  Top 0.61: IC24.2 166.37,8.89 165.1,7.62 165.1,3.81 166.37,2.54 C56.+ C57.+ 175.9,2.54 176.85,3.49 176.85,11.11 C51.1
N$9
  Top 0.254: R15.2 R16.1 R17.2 | R19.1 R18.1 R17.2 | IC5.9 R17.2
N$10
  Top 0.254: IC6.4 92.71,63.5 92.08,64.14 67.94,64.14 67.31,63.5 IC5.2 C28.1
N$11
  Top 0.254: R21.1 C8.1
N$12
  Top 0.254: R75.3 111.76,42.55 111.76,48.26 110.49,49.53 R61.2
N$13
  Top 0.254: R52.2 R53.1 IC5.6
N$14  (via drill 0.6)
  Top 0.254: v81.28,74.93 81.28,80.01 R18.2 | IC5.7 80.01,60.96 78.74,59.69 78.74,57.78 77.47,56.52 R53.2
  Bottom 0.254: IC5.7 80.01,63.5 81.28,64.77 v81.28,74.93
N$15
  Top 0.254: R17.1 C5.-
N$16
  Top 0.254: Q1.1 R6.2
N$17
  Top 0.254: R55.1 C35.1
N$19
  Top 0.254: D4.A C14.1 IC5.13 67.31,68.58 67.94,67.94 92.08,67.94 92.71,68.58 IC6.13
N$21
  Top 0.254: R67.2 138.43,43.81 R76.3
N$22
  Bottom 0.254: Q2.1 40.64,59.05 40.64,64.77 41.91,66.04 IC4.16
N$25  (via drill 0.6)
  Top 0.254: J3.T 119.96,97.16 v158.75,97.16 | v158.75,87.63 R35.1
  Bottom 0.254: v158.75,97.16 v158.75,87.63
N$26
  Top 0.254: R54.2 81.28,59.69 87.63,59.69 | 87.63,59.69 88.9,59.69 R55.2 | 87.63,59.69 IC6.2
N$27  (via drill 0.6)
  Top 0.254: v55.88,67.94 55.88,75.56 C7.- | v55.88,60.33 55.88,54.61 53.34,52.07 50.8,52.07 R48.1
  Bottom 0.254: v55.88,60.33 v55.88,67.94
N$28
  Top 0.254: D1.C 55.24,101.6 OK1.2 59.05,101.6 60.33,100.33 60.33,96.52 59.05,95.25 52.7,95.25 R1.2
N$29
  Top 0.254: R21.2 R20.2 IC6.15
N$32
  Top 0.254: R14.2 C6.-
N$38
  Top 0.254: IC9.1 133.35,60.96 132.08,59.69 129.54,59.69 D5.A 128.27,55.88 D6.C
N$39
  Top 0.254: R45.2 38.73,50.8 Q2.3
N$40
  Top 0.254: R69.2 R68.2 R67.1 R66.2 | D6.A R65.2 R66.2 | R66.2 IC9.2
N$43  (via drill 0.6)
  Top 0.254: IC22.5 55.88,9.53 54.61,8.26 40.64,8.26 39.37,9.53 31.75,9.53 v30.48,10.79
  Bottom 0.254: v30.48,10.79 IC15.4
N$44  (via drill 0.6)
  Top 0.254: IC22.6 58.42,9.53 56.52,7.62 36.2,7.62 v35.56,8.26
  Bottom 0.254: v35.56,8.26 IC15.6
N$47
  Top 0.254: R74.2 R74.1 105.41,48.26 R59.1
N$48
  Top 0.61: 171.45,5.08 C57.- | C56.- 171.45,5.08 | 171.45,5.08 IC24.4
N$49
  Top 0.61: C51.2 167.64,15.24 166.37,16.51 IC24.7
N$50
  Top 0.254: IC3.1 29.21,60.96 28.57,60.33 25.4,60.33 24.77,59.69 24.77,57.15 C25.2 31.75,55.88 33.02,54.61 40.01,54.61 Q2.2
N$51
  Top 0.254: IC6.12 95.25,68.58 95.89,67.94 112.39,67.94 113.03,68.58 IC7.6 113.03,75.56 113.67,76.2 C9.1 113.67,78.74 113.03,79.38 Q1.2
N$52
  Top 0.254: R13.2 R14.1 IC4.14
N$55
  Top 0.254: D3.C D4.C
N$57
  Top 0.254: IC8.3 C32.1 R64.2 R63.1
N$60
  Top 0.254: R56.2 97.79,60.96 IC6.6
N$61
  Top 0.254: R29.1 R30.2 | R29.1 R28.2 | IC9.6 R29.1
N$62
  Top 0.254: R58.2 IC6.7 | R60.2 R59.2 R58.2 | R57.2 R58.2
N$63
  Top 0.254: IC3.7 R10.2 31.75,74.93 33.02,76.2 C12.2 36.83,78.74 R11.1
N$64
  Top 0.254: C30.1 R57.1
N$70
  Top 0.254: IC4.12 52.07,68.58 51.44,67.94 34.92,67.94 34.29,68.58 IC3.6 C12.1 R11.2 R12.1
N$71
  Top 0.254: R42.2 R41.1 IC2.2
N$75
  Top 0.254: IC2.6 R8.2 R7.2
N$77
  Top 0.254: IC6.5 95.25,63.5 95.89,64.14 109.86,64.14 110.49,63.5 IC7.2 R61.1
N$79
  Top 0.254: R22.2 R23.2 R24.2 IC6.10
N$80
  Top 0.254: C17.1 95.25,78.74 R22.1
N$81  (via drill 0.6)
  Top 0.254: v162.56,67.94 136.53,67.94 135.89,68.58 IC9.7 135.89,71.75 134.62,73.03 134.62,76.2 138.43,80.01 R29.2
  Bottom 0.254: v162.56,67.94 163.83,66.67 IC10.6
N$82
  Top 0.254: IC23.10 124.46,8.89 125.6,7.75 Q3.1 128.27,4.45 129.54,5.71 C55.2
N$83
  Top 0.254: IC23.9 121.92,8.89 120.78,7.75 Q3.2 118.11,4.45 116.84,5.71 C54.2
N$85
  Top 0.254: R71.2 IC10.2 | R71.2 R72.1 | R70.2 R71.2
N$86  (via drill 0.6)
  Top 0.254: 121.92,74.93 C20.1 | v121.92,67.94 121.92,74.93 | R26.2 119.38,74.93 121.92,74.93
  Bottom 0.254: IC8.2 123.19,66.67 v121.92,67.94
N$91
  Top 0.254: R73.2 IC10.5
N$94
  Top 0.254: 165.1,73.66 R37.1 | R40.2 170.18,68.58 169.54,67.94 165.1,67.94 | 165.1,67.94 164.47,67.94 163.83,68.58 IC10.9 | 165.1,73.66 R36.2 | 165.1,67.94 165.1,73.66
N$98
  Top 0.254: R31.1 R32.2 R33.2 | R33.2 R35.2 R34.2 R33.2 | R33.2 IC10.13
N$99
  Top 0.254: R46.1 41.91,60.96 IC4.1
N$101
  Top 0.254: IC4.3 R47.1 R48.2
N$103
  Top 0.254: IC4.7 57.15,63.5 56.52,64.14 52.7,64.14 52.07,63.5 IC4.5 R49.2
N$106
  Top 0.254: R44.2 IC3.2 | R44.2 R45.1 | R44.2 R43.2 C25.1
PITCH_MOD
  Top 0.254: IC18.12 106.68,32.38 100.33,38.73 85.72,38.73 84.45,40.01 74.3,40.01 69.22,45.09 22.23,45.09 14.61,52.7 14.61,62.87 7.62,69.85 J5.3
POT1
  Top 0.254: IC17.12 83.82,33.02 80.64,36.2 70.48,36.2 65.41,41.27 18.41,41.27 10.79,48.9 10.79,59.05 7.62,62.23 J5.9
POT2
  Top 0.254: IC17.13 81.28,33.02 78.74,35.56 69.85,35.56 64.77,40.64 17.78,40.64 10.16,48.26 10.16,58.42 7.62,60.96 5.08,60.96 J5.10
POT3
  Top 0.254: IC17.14 78.74,33.02 76.83,34.92 69.22,34.92 64.14,40.01 17.14,40.01 9.53,47.62 9.53,57.78 7.62,59.69 J5.11
POT4
  Top 0.254: IC17.15 76.2,33.02 74.93,34.29 68.58,34.29 63.5,39.37 16.51,39.37 8.89,46.99 8.89,57.15 7.62,58.42 5.08,58.42 J5.12
POT5
  Top 0.254: IC17.1 69.22,24.13 66.67,26.67 66.67,34.92 62.87,38.73 15.88,38.73 8.26,46.35 8.26,55.88 6.99,57.15 J5.13
POT6
  Top 0.254: IC17.2 76.2,22.86 75.56,22.23 69.85,22.23 66.04,26.04 66.04,34.29 62.23,38.1 15.24,38.1 7.62,45.72 7.62,55.24 6.99,55.88 5.08,55.88 J5.14
POT7
  Top 0.254: IC17.4 81.28,22.86 80.01,21.59 69.22,21.59 65.41,25.4 65.41,33.66 61.59,37.47 14.61,37.47 6.99,45.09 6.99,53.98 J5.15
POT8
  Top 0.254: IC17.5 83.82,22.86 81.92,20.95 68.58,20.95 64.77,24.77 64.77,33.02 60.96,36.83 13.97,36.83 6.35,44.45 6.35,52.07 J5.16
POT9  (via drill 0.6)
  Top 0.254: v93.98,31.11 93.98,32.38 92.71,33.66 84.45,33.66 81.28,36.83 71.12,36.83 66.04,41.91 19.05,41.91 11.43,49.53 11.43,59.69 7.62,63.5 5.08,63.5 J5.8
  Bottom 0.254: v93.98,31.11 93.98,27.94 96.52,25.4 IC18.1
POT10  (via drill 0.6)
  Top 0.254: v97.79,33.66 97.79,35.56 97.16,36.2 83.19,36.2 81.92,37.47 71.75,37.47 66.67,42.55 19.68,42.55 12.06,50.16 12.06,60.33 7.62,64.77 J5.7
  Bottom 0.254: IC18.2 99.06,25.4 97.79,26.67 v97.79,33.66
PW_MOD
  Top 0.254: IC18.15 99.06,35.56 97.79,36.83 83.82,36.83 82.55,38.1 72.39,38.1 67.31,43.18 20.32,43.18 12.7,50.8 12.7,60.96 7.62,66.04 5.08,66.04 J5.6
PW_POT
  Top 0.254: R30.1 142.24,81.28 144.78,83.82 J6.7
PWM_OUT  (via drill 0.6)
  Top 0.254: v121.92,12.7 116.84,12.7 115.57,11.43 115.57,8.89 114.94,8.26 112.39,8.26 111.76,8.89 IC23.5 | v137.79,13.97 147.96,13.97 192.41,58.42 192.41,73.66 188.59,77.47 183.51,77.47 168.28,92.71 C2.-
  Bottom 0.254: v121.92,12.7 136.53,12.7 v137.79,13.97
REF_4.096_CV_OUT  (via drill 0.6)
  Top 0.254: R42.1 21.59,52.7 17.78,56.52 v17.78,64.77 | R9.1 26.67,78.74 C10.1 24.77,76.2 22.86,74.3 22.86,68.58 22.23,67.94 v17.78,67.94 | R9.1 R8.1 | R9.1 IC1.2
  Bottom 0.254: v17.78,64.77 v17.78,67.94
REF_4.096_TC
  Top 0.254: R56.1 92.71,48.26 83.82,48.26 | 83.82,48.26 C36.1 | 78.74,48.26 83.82,48.26 | R51.1 74.93,48.26 78.74,48.26 | 78.74,48.26 IC12.2
REF_-4.096
  Top 0.254: R66.1 135.89,48.9 131.44,44.45 128.91,44.45 | 128.91,44.45 115.57,44.45 111.12,40.01 106.68,40.01 R74.3 | 128.91,44.45 C37.1 127.64,47.62 122.56,47.62 IC13.3 120.02,46.35 R62.2
RES_IN  (via drill 0.6)
  Top 0.254: v61.59,64.14 61.59,55.88 65.41,52.07 73.66,52.07 R52.1 | v61.59,67.94 61.59,81.28 60.33,82.55 54.61,82.55 53.98,83.19 47.62,83.19 46.99,83.82 J7.3
  Bottom 0.254: v61.59,64.14 v61.59,67.94
RST
  Top 0.254: IC23.1 R77.1 102.87,4.45 116.2,4.45 117.47,3.17 128.91,3.17 130.18,4.45 136.53,4.45 ISP.5
SAW_INV
  Top 0.254: R73.1 162.56,52.07 162.56,64.14 | 162.56,64.14 173.35,64.14 173.99,63.5 IC11.1 | 151.13,64.14 IC10.1 151.13,60.96 149.86,59.69 149.86,57.78 150.5,57.15 153.67,57.15 156.21,54.61 R72.2 | 151.13,64.14 162.56,64.14 | R39.1 147.32,63.5 147.96,64.14 151.13,64.14
SCK
  Top 0.254: 129.54,22.23 127.64,22.23 124.46,19.05 IC23.19 124.46,15.88 126.36,13.97 133.99,13.97 140.34,7.62 ISP.3 | 129.54,22.23 145.41,22.23 146.05,22.86 IC20.3 | 129.54,22.23 IC19.3
SQUARE
  Top 0.254: R40.1 IC10.7 166.37,60.96 163.83,58.42 163.83,50.8 161.93,48.9 151.45,48.9 147.32,53.02 147.32,59.05 144.78,61.59 R38.1
SS_DAC1
  Top 0.254: IC23.15 134.62,19.05 135.25,19.68 147.32,19.68 149.86,22.23 149.86,25.4 149.22,26.04 144.15,26.04 143.51,25.4 IC20.2
SS_DAC2
  Top 0.254: IC23.13 132.08,11.43 130.18,13.34 125.73,13.34 123.19,15.88 123.19,19.68 127,23.5 IC19.2
SUB
  Top 0.254: J6.1 152.4,83.82 153.67,82.55 154.94,82.55 R34.1
V+
  Top 1.016: C38.+ IC14.IN | IC24.8 163.83,20.32 184.15,40.64 C38.+ | C38.+ 189.23,44.45 189.23,48.9 192.41,52.07 JP1.1 JP1.2 196.85,52.07 196.85,87 D2.C
V-
  Top 1.016: IC24.5 176.53,17.78 181.61,12.7 181.61,8.89 184.15,6.35 C52.- 186.69,6.35 187.96,7.62 187.96,9.53 | 187.96,9.53 187.96,15.24 189.23,16.51 IC21.IN | JP1.9 JP1.10 196.85,40.64 196.85,10.16 196.22,9.53 187.96,9.53
VCA_CV_IN  (via drill 0.6)
  Top 0.254: v39.37,69.22 39.37,71.12 40.64,72.39 40.64,77.47 38.1,80.01 38.1,82.55 36.83,83.82 J7.11 | v38.73,60.33 38.73,58.42 40.01,57.15 41.91,57.15 42.55,56.52 42.55,50.8 41.27,49.53 33.02,49.53 R44.1
  Bottom 0.254: v38.73,60.33 38.73,62.23 39.37,62.87 v39.37,69.22
VCA_IN
  Top 0.254: C6.+ 43.81,78.74 39.37,83.19 J7.9
VCC  (via drill 0.6)
  Top 0.254: C29.1 R51.2 | C11.1 27.94,74.93 25.4,74.93 R9.2 | R27.2 127,80.01 127,73.03 125.73,71.75 IC8.6 | R63.2 114.3,57.15 v114.3,60.33
  Top 0.406: 74.93,99.69 74.93,101.6 R2.2 C1.1 OK1.8 | 74.93,99.69 R3.2 | IC18.16 C39.1 | IC17.16 C40.1 68.58,31.75 67.94,31.11 v67.94,27.3 v96.52,27.3 | IC16.10 60.96,33.51 58.91,35.56 v45.72,35.56 | IC22.16 C50.1 41.91,19.68 23.5,19.68 C47.1 | 74.93,99.69 163.83,99.69 167.64,95.89 141.6,95.89 134.62,88.9 J6.16 | 86.36,9.53 v86.36,10.79
  Top 0.61: IC20.1 140.97,25.4 139.06,27.3 C42.1 124.46,27.3 | IC23.7 116.84,8.26 115.57,6.99 113.03,6.99 C53.1 R77.2 | 124.46,27.3 IC19.1 124.46,22.86 123.19,21.59 C46.1 IC23.20 | 124.46,27.3 C41.1 | IC10.4 C34.1 | C23.1 IC11.14 173.99,66.67 | C13.1 IC4.11 54.61,66.67 | IC5.4 72.39,60.96 C29.1 | IC6.16 C16.1 | C21.1 IC9.8 133.35,66.67 | 16.51,66.67 IC2.8 | v187.96,66.67 173.99,66.67 | 173.99,66.67 v160.02,66.67 133.35,66.67 | 133.35,66.67 128.27,66.67 | 128.27,66.67 125.73,66.67 | 125.73,66.67 120.65,66.67 | 120.65,66.67 v114.3,66.67 v107.95,66.67 v85.09,66.67 v73.66,66.67 54.61,66.67 | 54.61,66.67 29.21,66.67 | 29.21,66.67 16.51,66.67 | 109.22,1.27 v109.22,1.91 | 29.21,66.67 IC3.8 C11.1 | 142.88,1.27 144.78,1.27 147.32,3.81 147.32,8.89 v179.71,41.27 | 142.88,1.27 109.22,1.27 | 142.88,1.27 ISP.2 | v194.94,66.67 194.94,75.56 189.87,80.64 184.78,80.64 169.54,95.89 167.64,95.89 | v27.3,3.17 29.21,1.27 63.5,1.27 71.75,9.53 86.36,9.53 94.61,9.53 102.87,1.27 109.22,1.27 | 16.51,66.67 13.34,66.67 7.62,72.39 J5.1 | 120.65,66.67 IC8.8 C19.1 | 128.27,66.67 IC8.5 | 125.73,66.67 IC8.6
  Top 0.813: v179.71,41.27 194.94,56.52 v194.94,66.67
  Top 1.016: IC14.OUT 189.23,27.94 187.96,29.21 C44.+ C43.1
  Bottom 0.254: v114.3,66.67 v114.3,60.33
  Bottom 0.406: v45.72,35.56 IC16.16 45.72,30.48 43.18,27.94 C50.1 | C47.1 IC15.1 | v96.52,27.3 IC18.16 | v67.94,27.3 64.14,27.3 60.96,30.48 IC16.10 | v86.36,10.79 JP4.5
  Bottom 0.61: IC23.20 121.92,16.51 116.84,11.43 IC23.7 | IC10.4 158.75,64.14 160.02,65.41 v160.02,66.67 | v85.09,66.67 IC6.16 | IC5.4 72.39,63.5 73.66,64.77 v73.66,66.67 | C47.1 22.86,19.05 27.3,14.61 RN1.1 v27.3,3.17 | v109.22,1.91 R77.2 | v107.95,66.67 IC7.8
  Bottom 0.813: v179.71,41.27 C43.1 | v187.96,66.67 v194.94,66.67
VCF_CV_IN  (via drill 0.6)
  Top 0.254: v130.81,69.22 131.44,69.85 131.44,78.74 135.25,82.55 140.34,82.55 142.24,84.45 J6.9 | v132.08,57.15 133.99,55.24 139.06,55.24 R69.1
  Bottom 0.254: v130.81,69.22 130.81,60.33 132.08,59.05 v132.08,57.15
VCF_CV_OUT
  Top 0.254: IC2.7 19.05,71.12 17.78,72.39 17.78,80.01 R7.1 19.05,85.09 20.95,87 28.57,87 30.48,85.09 J7.15
VCF_OUT
  Top 0.254: C7.+ 58.42,81.92 53.98,81.92 53.34,82.55 46.99,82.55 45.72,83.82 45.72,86.36 J7.6
VCF_OVERDRIVE  (via drill 0.6)
  Top 0.254: R50.2 IC4.8 | v58.42,67.94 58.42,75.56 60.33,77.47 60.33,79.38 59.69,80.01 43.81,80.01 40.64,83.19 40.64,85.72 40.01,86.36 38.1,86.36 J7.12
  Bottom 0.254: IC4.8 59.69,63.5 58.42,64.77 v58.42,67.94
VCO_CV_IN
  Top 0.254: J6.6 147.32,88.9 148.59,90.17 167,90.17 181.61,75.56 186.69,75.56 190.5,71.75 190.5,60.33 187.32,57.15 180.34,57.15 177.8,59.69 166.37,59.69 164.47,57.78 164.47,50.16 162.56,48.26 152.4,48.26 151.13,46.99 148.59,46.99 141.6,40.01 126.36,40.01 125.73,40.64 123.83,40.64 122.56,39.37 105.41,39.37 100.33,44.45 R58.1
VCO_CV_OUT  (via drill 0.6)
  Top 0.254: IC2.1 16.51,54.61 19.05,52.07 R41.2 | v14.61,67.94 14.61,79.38 14.61,80.01 14.61,81.92 20.32,87.63 J7.16
  Bottom 0.254: IC2.1 16.51,63.5 14.61,65.41 v14.61,67.94
VCO_RAMP
  Top 0.254: C9.2 C9.3 106.05,80.01 R25.2 106.05,82.55 107.31,83.82 Q1.3
VCO_SAW_CORE  (via drill 0.6)
  Top 0.254: R70.1 147.96,53.98 147.96,59.69 146.05,61.59 146.05,62.87 144.78,64.14 v111.76,64.14 | IC7.7 110.49,71.12 107.95,73.66 R25.1 104.78,74.93 104.78,83.19 106.68,85.09 113.67,85.09 114.3,84.45 114.3,82.55 115.57,81.28 R26.1
  Bottom 0.254: v111.76,64.14 111.76,67.31 110.49,68.58 IC7.7
VCO_SYNC  (via drill 0.6)
  Top 0.254: C32.2 127,57.15 v127,60.33 | v127,71.75 130.18,74.93 130.18,80.01 133.99,83.82 136.53,83.82 137.16,84.45 J6.13
  Bottom 0.254: v127,60.33 v127,71.75
VCO_TUNING_FB  (via drill 0.6)
  Top 0.254: IC10.8 166.37,71.12 167.64,72.39 167.64,80.01 R37.2 | v167.64,58.42 167.64,37.47 147,16.83 140.65,16.83 v140.34,17.14
  Bottom 0.254: IC10.8 166.37,68.58 167.64,67.31 v167.64,58.42 | v140.34,17.14 140.34,12.7 137.79,10.16 IC23.14
VEE  (via drill 0.6)
  Top 0.254: R23.1 101.6,77.47 101.6,74.93 C18.2 | R71.1 154.94,49.53 156.84,49.53 157.48,50.16 v157.48,60.33
  Top 0.406: IC10.11 158.75,71.12 C22.2 163.83,76.2 R36.1 | R50.1 58.42,52.07 58.42,65.41 | 185.42,65.41 185.42,59.69 C24.2 187.32,58.42 189.23,60.33 IC11.7
  Top 0.61: 36.83,65.41 v54.61,65.41 58.42,65.41 v71.12,65.41 v102.87,65.41 v118.11,65.41 v128.27,65.41 v140.97,65.41 v157.48,65.41 176.53,65.41 | 36.83,65.41 IC3.4 C26.2 | v189.23,65.41 185.42,65.41 176.53,65.41 | IC2.4 27.3,65.41 36.83,65.41 | 176.53,65.41 IC11.2 | IC4.6 C27.2 | C15.2 72.39,71.12 IC5.11 | IC6.9 C18.2 | C33.2 144.15,60.33 141.6,60.33 140.97,60.96 IC9.4 | IC21.OUT 194.31,13.97 195.58,15.24 195.58,19.68 194.31,20.95 189.87,20.95 186.69,17.78 C49.- C48.2 | v177.8,41.91 193.68,57.78 v193.68,65.41 193.68,74.93 189.23,79.38 184.15,79.38 168.91,94.61 143.51,94.61 139.7,90.81 J6.12 | IC8.1 120.65,60.33 118.75,58.42 C31.2 R62.1 IC7.4
  Bottom 0.254: v157.48,65.41 v157.48,60.33
  Bottom 0.61: v54.61,65.41 IC4.6 | IC5.11 72.39,67.94 71.12,66.67 v71.12,65.41 | v102.87,65.41 IC6.9 | v140.97,65.41 IC9.4 | v157.48,65.41 157.48,67.31 158.75,68.58 IC10.11 | C48.2 177.8,19.68 v177.8,41.91 | v193.68,65.41 v189.23,65.41 | v128.27,65.41 IC8.4 | v118.11,65.41 C31.2
VOL_IN
  Top 0.254: R10.1 34.29,83.82 J7.13
VOL_OUT
  Top 0.254: J7.14 35.56,88.9 53.34,88.9 54.61,87.63 74.3,87.63 79.38,92.71 93.34,92.71 93.61,92.45 J2.T

## Text on the board
tNames: NP | NP | NP | NP | Remove LT1054 (IC24) | before connecting | Eurorack power supply | +12V | GND | -12V | VCA | PW | GND | VCO | VCF | GND | Offset | V/Oct | V/Oct | VCO | VCF | EN< | CLK< | SER< | GND | +5V | (eurosceptic dc-dc converter)
200bmp: cc-by-sa, Émilie Gillet, 2012. rev. C